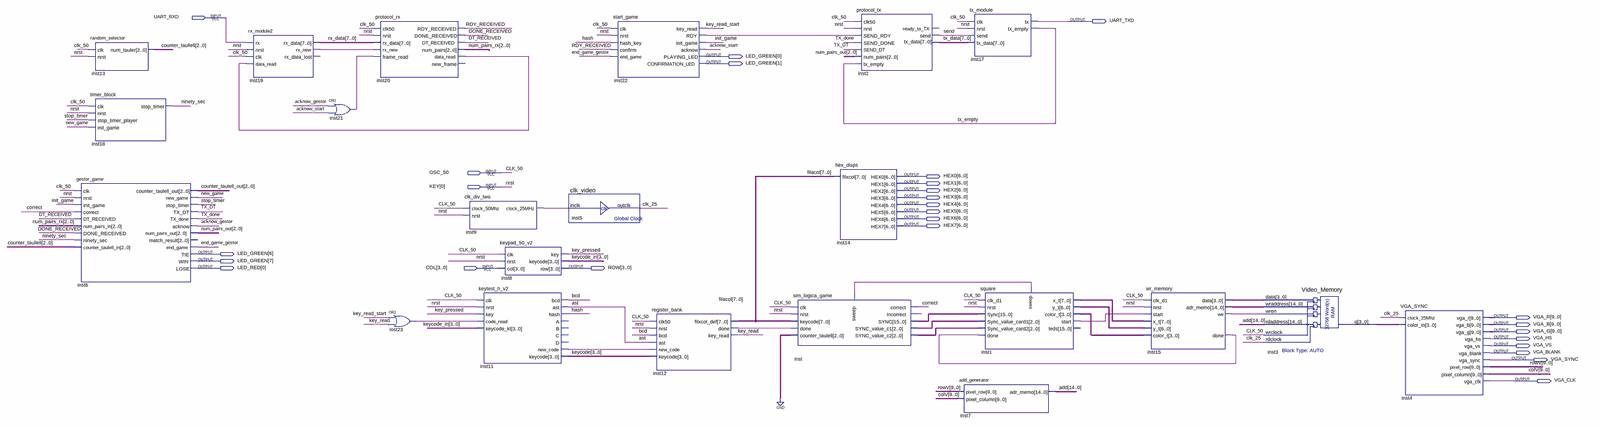
[diagram p0: schematic sheet, whole]
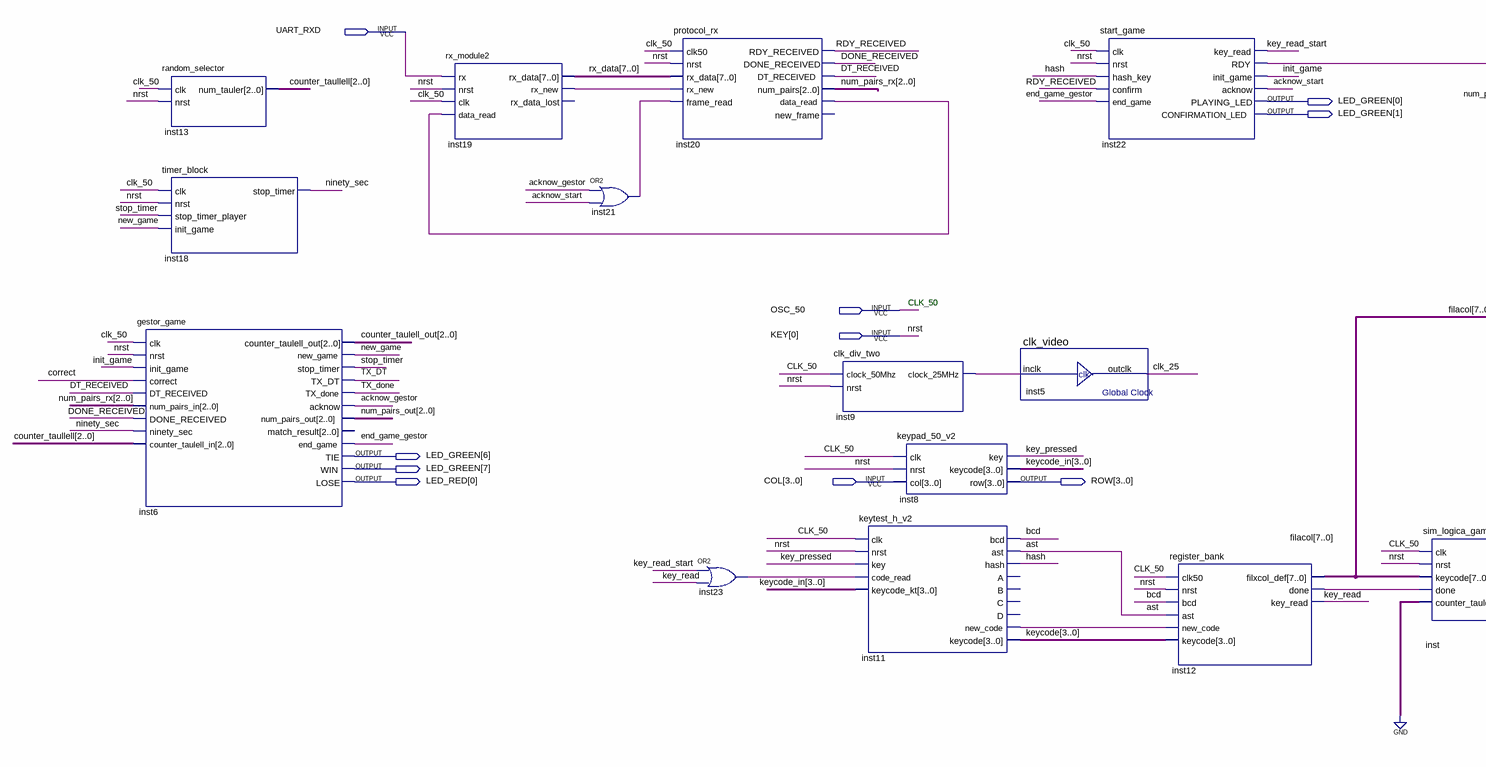
[diagram p1: schematic sheet, left part]
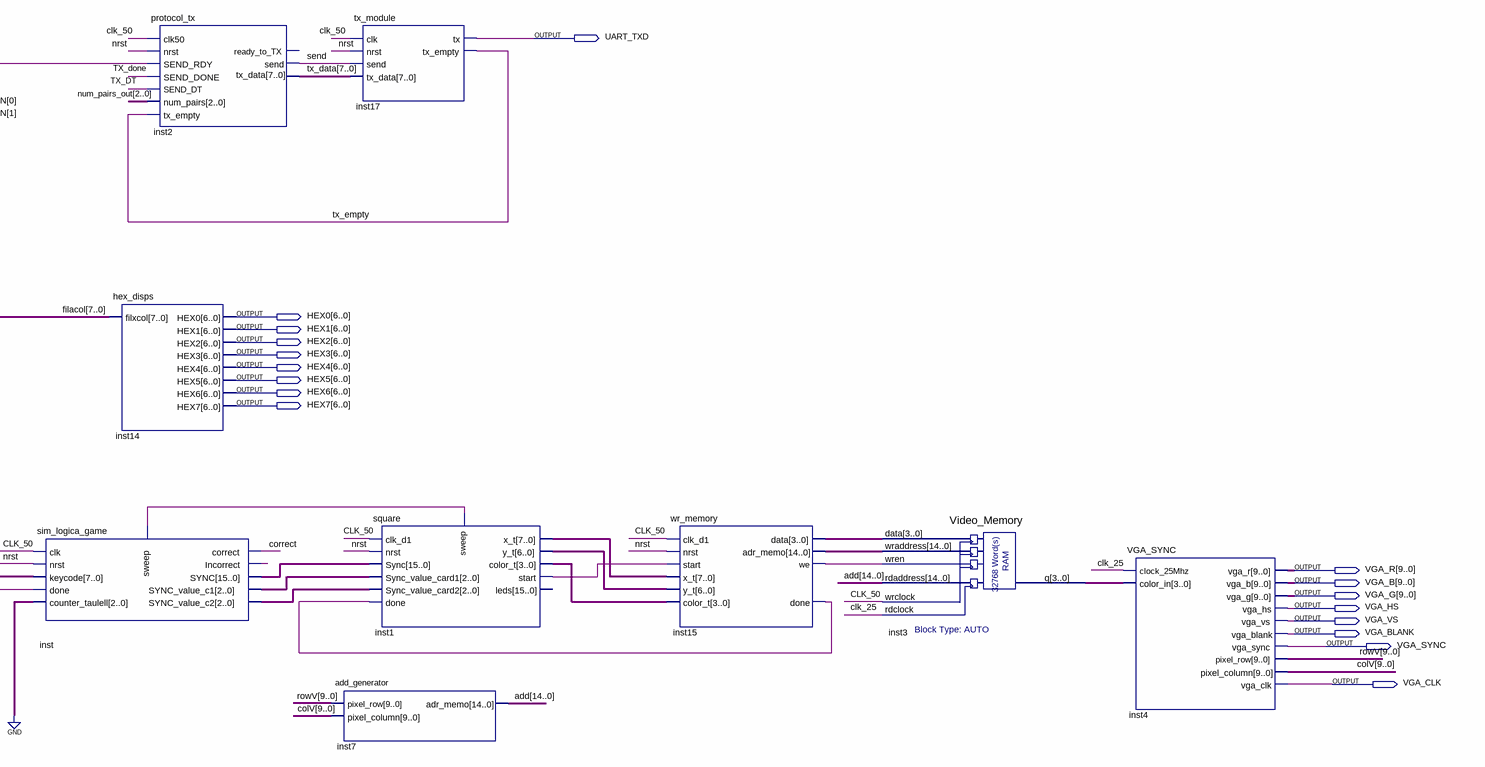
[diagram p2: schematic sheet, right part]
// Quartus schematic sim_beta.bdf as structural Verilog: 22 symbols, 27 pins
module sim_beta (
  input  UART_RXD,
  input  OSC_50,
  input  [0:0] KEY,
  input  [3:0] COL,
  output UART_TXD,
  output [7:0] LED_GREEN,
  output [6:0] HEX0,
  output [6:0] HEX1,
  output [6:0] HEX2,
  output [6:0] HEX3,
  output [6:0] HEX4,
  output [6:0] HEX5,
  output [6:0] HEX6,
  output [6:0] HEX7,
  output [0:0] LED_RED,
  output [3:0] ROW,
  output [9:0] VGA_R,
  output [9:0] VGA_B,
  output [9:0] VGA_G,
  output VGA_HS,
  output VGA_VS,
  output VGA_BLANK,
  output VGA_SYNC,
  output VGA_CLK
);

  wire acknow_gestor, acknow_start, ast, bcd, clk_25, correct, DONE_RECEIVED, DT_RECEIVED, end_game_gestor,
       hash, init_game, inst1_start, inst1_sweep, inst9_clock_25mhz, inst11_new_code, inst12_done,
       inst15_done, inst15_we, inst19_rx_new, inst20_data_read, inst21_out, inst22_rdy, inst23_out,
       inst_incorrect, key_pressed, key_read, key_read_start, new_game, ninety_sec, RDY_RECEIVED, send,
       stop_timer, TX_done, TX_DT, tx_empty;
  wire [2:0] counter_taulell_out, counter_taullell, inst_sync_value_c1, inst_sync_value_c2, num_pairs_out,
       num_pairs_rx;
  wire [3:0] inst1_color_t, inst3_q, inst15_data, keycode, keycode_in;
  wire [6:0] inst1_y_t;
  wire [7:0] filacol, inst1_x_t, rx_data, tx_data;
  wire [9:0] colV, rowV;
  wire [14:0] add, inst15_adr_memo;
  wire [15:0] inst_sync;

  gestor_game inst6 (
    .clk(OSC_50), .nrst(KEY[0]), .init_game(init_game), .correct(correct), .DT_RECEIVED(DT_RECEIVED),
    .num_pairs_in(num_pairs_rx), .DONE_RECEIVED(DONE_RECEIVED), .ninety_sec(ninety_sec),
    .counter_taulell_in(counter_taullell), .counter_taulell_out(counter_taulell_out), .new_game(new_game),
    .stop_timer(stop_timer), .TX_DT(TX_DT), .TX_done(TX_done), .acknow(acknow_gestor),
    .num_pairs_out(num_pairs_out), .end_game(end_game_gestor), .TIE(LED_GREEN[6]), .WIN(LED_GREEN[7]),
    .LOSE(LED_RED[0]));  // open: match_result
  random_selector inst13 (.clk(OSC_50), .nrst(KEY[0]), .num_tauler(counter_taullell));
  timer_block inst18 (
    .clk(OSC_50), .nrst(KEY[0]), .stop_timer_player(stop_timer), .init_game(new_game), .stop_timer(ninety_sec));
  rx_module2 inst19 (
    .clk(OSC_50), .nrst(KEY[0]), .rx(UART_RXD), .data_read(inst20_data_read), .rx_data(rx_data),
    .rx_new(inst19_rx_new));  // open: rx_data_lost
  or inst21 (inst21_out, acknow_gestor, acknow_start);
  protocol_rx inst20 (
    .clk50(OSC_50), .nrst(KEY[0]), .rx_data(rx_data), .rx_new(inst19_rx_new), .frame_read(inst21_out),
    .RDY_RECEIVED(RDY_RECEIVED), .DONE_RECEIVED(DONE_RECEIVED), .DT_RECEIVED(DT_RECEIVED),
    .num_pairs(num_pairs_rx), .data_read(inst20_data_read));  // open: new_frame
  or inst23 (inst23_out, key_read_start, key_read);
  clk_div_two inst9 (.clock_50Mhz(OSC_50), .nrst(KEY[0]), .clock_25MHz(inst9_clock_25mhz));
  keytest_h_v2 inst11 (
    .clk(OSC_50), .nrst(KEY[0]), .key(key_pressed), .code_read(inst23_out), .keycode_kt(keycode_in),
    .bcd(bcd), .ast(ast), .hash(hash), .new_code(inst11_new_code), .keycode(keycode));  // open: A, B, C, D
  keypad_50_v2 inst8 (.clk(OSC_50), .nrst(KEY[0]), .col(COL), .key(key_pressed), .keycode(keycode_in), .row(ROW));
  clk_video inst5 (.inclk(inst9_clock_25mhz), .outclk(clk_25));
  start_game inst22 (
    .clk(OSC_50), .nrst(KEY[0]), .hash_key(hash), .confirm(RDY_RECEIVED), .end_game(end_game_gestor),
    .key_read(key_read_start), .RDY(inst22_rdy), .init_game(init_game), .acknow(acknow_start),
    .PLAYING_LED(LED_GREEN[0]), .CONFIRMATION_LED(LED_GREEN[1]));
  register_bank inst12 (
    .clk50(OSC_50), .nrst(KEY[0]), .bcd(bcd), .ast(ast), .new_code(inst11_new_code), .keycode(keycode),
    .filxcol_def(filacol), .key_read(key_read), .done(inst12_done));
  sim_logica_game inst (
    .clk(OSC_50), .nrst(KEY[0]), .keycode(filacol), .counter_taulell(3'b000), .done(inst12_done),
    .sweep(inst1_sweep), .correct(correct), .Incorrect(inst_incorrect), .SYNC(inst_sync),
    .SYNC_value_c1(inst_sync_value_c1), .SYNC_value_c2(inst_sync_value_c2));
  hex_disps inst14 (
    .filxcol(filacol), .HEX0(HEX0), .HEX1(HEX1), .HEX2(HEX2), .HEX3(HEX3), .HEX4(HEX4), .HEX5(HEX5),
    .HEX6(HEX6), .HEX7(HEX7));
  protocol_tx inst2 (
    .clk50(OSC_50), .nrst(KEY[0]), .SEND_RDY(inst22_rdy), .SEND_DONE(TX_done), .SEND_DT(TX_DT),
    .num_pairs(num_pairs_out), .tx_empty(tx_empty), .tx_data(tx_data), .send(send));  // open: ready_to_TX
  add_generator inst7 (.pixel_row(rowV), .pixel_column(colV), .adr_memo(add));
  tx_module inst17 (.clk(OSC_50), .nrst(KEY[0]), .send(send), .tx_data(tx_data), .tx(UART_TXD), .tx_empty(tx_empty));
  square inst1 (
    .clk_d1(OSC_50), .nrst(KEY[0]), .Sync(inst_sync), .Sync_value_card1(inst_sync_value_c1),
    .Sync_value_card2(inst_sync_value_c2), .done(inst15_done), .x_t(inst1_x_t), .y_t(inst1_y_t),
    .color_t(inst1_color_t), .start(inst1_start), .sweep(inst1_sweep));  // open: leds
  wr_memory inst15 (
    .clk_d1(OSC_50), .start(inst1_start), .nrst(KEY[0]), .x_t(inst1_x_t), .y_t(inst1_y_t),
    .color_t(inst1_color_t), .we(inst15_we), .done(inst15_done), .data(inst15_data),
    .adr_memo(inst15_adr_memo));
  Video_Memory inst3 (
    .data(inst15_data), .wraddress(inst15_adr_memo), .wren(inst15_we), .rdaddress(add), .wrclock(OSC_50),
    .rdclock(clk_25), .q(inst3_q));
  VGA_SYNC inst4 (
    .clock_25Mhz(clk_25), .color_in(inst3_q), .vga_r(VGA_R), .vga_b(VGA_B), .vga_g(VGA_G), .vga_hs(VGA_HS),
    .vga_vs(VGA_VS), .vga_blank(VGA_BLANK), .vga_sync(VGA_SYNC), .pixel_row(rowV), .pixel_column(colV),
    .vga_clk(VGA_CLK));

  // Other names for the same wires on the sheet: CLK_50 = OSC_50; nrst = KEY[0]

  // Notes on the sheet:
  //   CLK_50
endmodule
